# Altium schematic sheet alcd.SchDoc: alcd
size A4; SheetNumber: 1; SheetTotal: 1
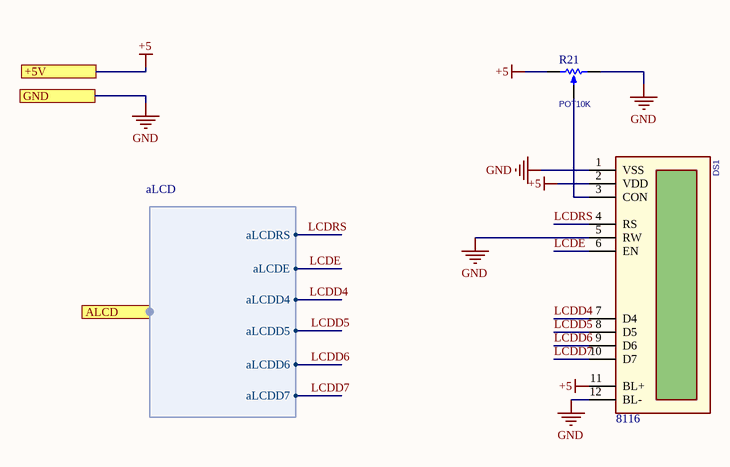
[diagram p0: alcd.SchDoc]

## Parts
DS1  Inflow: 8116  [BOX-HDR-2x6-2.54mm-S]  (hidden comment: 16x2)
R21  POT10K  [POT_3296W]

## Ports
+5V, ALCD (harness aLCD), GND

## Harnesses
aLCD: aLCDRS, aLCDE, aLCDD4, aLCDD5, aLCDD6, aLCDD7

## Nets
+5: DS1.2(VDD) DS1.11(BL+) R21.1(TOP) ; port +5V
GND: DS1.1(VSS) DS1.5(RW) DS1.12(BL-) R21.3(BOT) ; port GND
LCDD4: DS1.7(D4) ; port ALCD.aLCDD4
LCDD5: DS1.8(D5) ; port ALCD.aLCDD5
LCDD6: DS1.9(D6) ; port ALCD.aLCDD6
LCDD7: DS1.10(D7) ; port ALCD.aLCDD7
LCDE: DS1.6(EN) ; port ALCD.aLCDE
LCDRS: DS1.4(RS) ; port ALCD.aLCDRS
NetDS1_3: DS1.3(CON) R21.2(TAP)

## Notes on the sheet
- Title:
- Project:
- Drawn by:
- Revision:
- Hossein Bagheri
- Company:
- Sheet
- of

## Library data of the parts
DS1 = ModSen_LCD_CH_16x2_Box: Alphanumeric LCD character; Rating: Rating?; Validation: Valid; Value: 16x2; Package: Dip; Type: Alphanumeric
R21 = RES_THD_POT_MULTITURN: RESISTOR, THD, Potentiometer Multiturn, most Popular; VALUE: POT10K